# EAGLE design untitled (EAGLE 6.3)
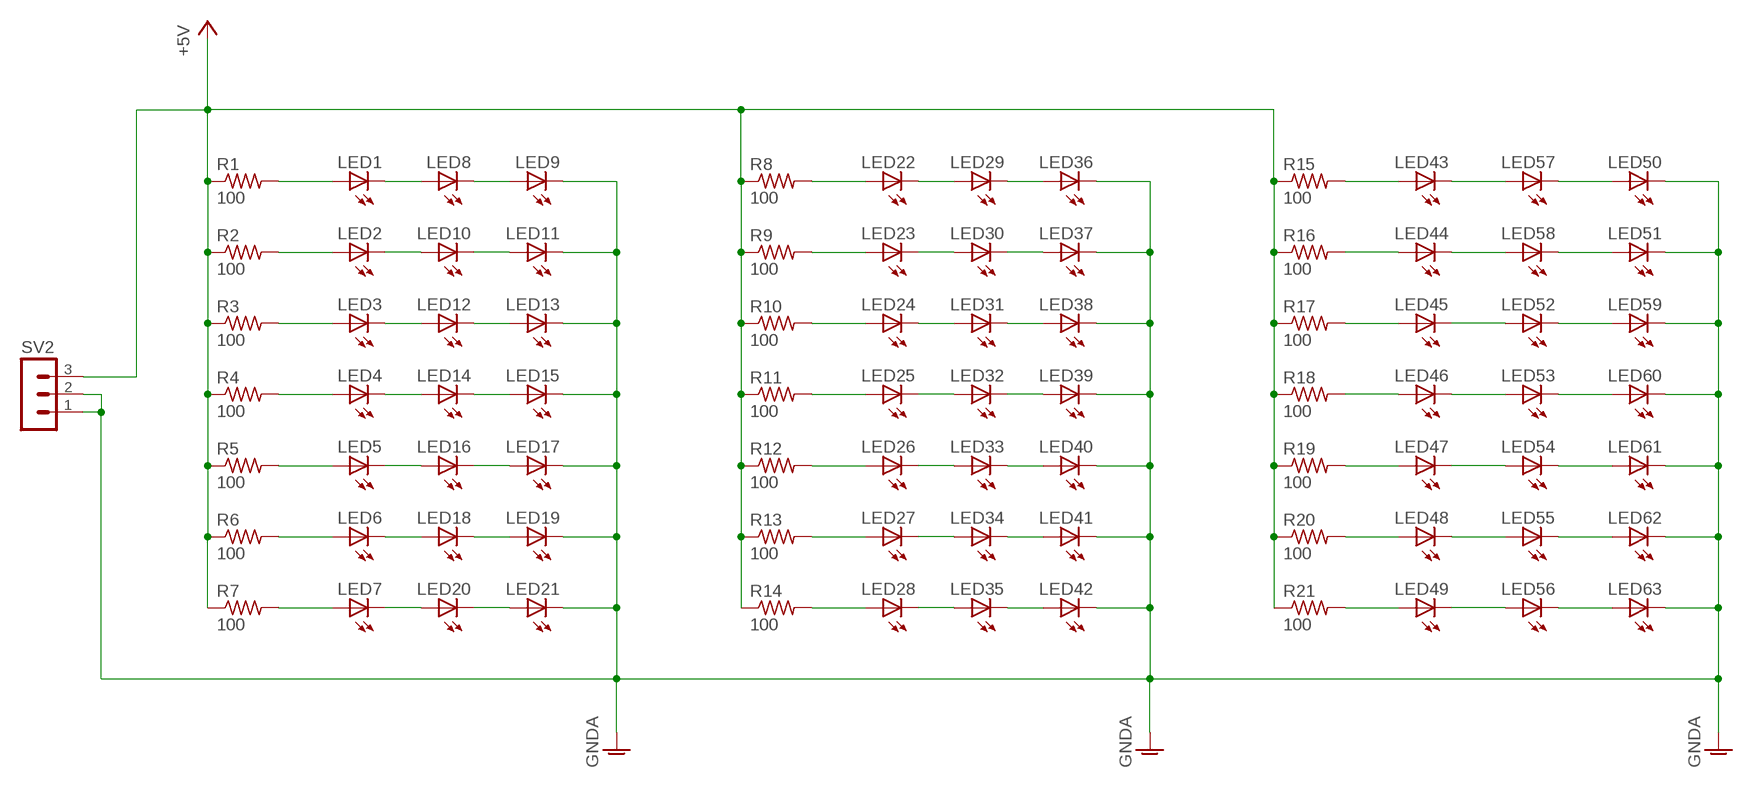
[diagram p0: schematic, sheet 1]

## Parts
LED1  LED5MM  [LED5MM]
LED2  LED5MM  [LED5MM]
LED3  LED5MM  [LED5MM]
LED4  LED5MM  [LED5MM]
LED5  LED5MM  [LED5MM]
LED6  LED5MM  [LED5MM]
LED7  LED5MM  [LED5MM]
LED8  LED5MM  [LED5MM]
LED9  LED5MM  [LED5MM]
LED10  LED5MM  [LED5MM]
LED11  LED5MM  [LED5MM]
LED12  LED5MM  [LED5MM]
LED13  LED5MM  [LED5MM]
LED14  LED5MM  [LED5MM]
LED15  LED5MM  [LED5MM]
LED16  LED5MM  [LED5MM]
LED17  LED5MM  [LED5MM]
LED18  LED5MM  [LED5MM]
LED19  LED5MM  [LED5MM]
LED20  LED5MM  [LED5MM]
LED21  LED5MM  [LED5MM]
LED22  LED5MM  [LED5MM]
LED23  LED5MM  [LED5MM]
LED24  LED5MM  [LED5MM]
LED25  LED5MM  [LED5MM]
LED26  LED5MM  [LED5MM]
LED27  LED5MM  [LED5MM]
LED28  LED5MM  [LED5MM]
LED29  LED5MM  [LED5MM]
LED30  LED5MM  [LED5MM]
LED31  LED5MM  [LED5MM]
LED32  LED5MM  [LED5MM]
LED33  LED5MM  [LED5MM]
LED34  LED5MM  [LED5MM]
LED35  LED5MM  [LED5MM]
LED36  LED5MM  [LED5MM]
LED37  LED5MM  [LED5MM]
LED38  LED5MM  [LED5MM]
LED39  LED5MM  [LED5MM]
LED40  LED5MM  [LED5MM]
LED41  LED5MM  [LED5MM]
LED42  LED5MM  [LED5MM]
LED43  LED5MM  [LED5MM]
LED44  LED5MM  [LED5MM]
LED45  LED5MM  [LED5MM]
LED46  LED5MM  [LED5MM]
LED47  LED5MM  [LED5MM]
LED48  LED5MM  [LED5MM]
LED49  LED5MM  [LED5MM]
LED50  LED5MM  [LED5MM]
LED51  LED5MM  [LED5MM]
LED52  LED5MM  [LED5MM]
LED53  LED5MM  [LED5MM]
LED54  LED5MM  [LED5MM]
LED55  LED5MM  [LED5MM]
LED56  LED5MM  [LED5MM]
LED57  LED5MM  [LED5MM]
LED58  LED5MM  [LED5MM]
LED59  LED5MM  [LED5MM]
LED60  LED5MM  [LED5MM]
LED61  LED5MM  [LED5MM]
LED62  LED5MM  [LED5MM]
LED63  LED5MM  [LED5MM]
R1  100  R-US_0204/5  [0204/5]
R2  100  R-US_0204/5  [0204/5]
R3  100  R-US_0204/5  [0204/5]
R4  100  R-US_0204/5  [0204/5]
R5  100  R-US_0204/5  [0204/5]
R6  100  R-US_0204/5  [0204/5]
R7  100  R-US_0204/5  [0204/5]
R8  100  R-US_0204/5  [0204/5]
R9  100  R-US_0204/5  [0204/5]
R10  100  R-US_0204/5  [0204/5]
R11  100  R-US_0204/5  [0204/5]
R12  100  R-US_0204/5  [0204/5]
R13  100  R-US_0204/5  [0204/5]
R14  100  R-US_0204/5  [0204/5]
R15  100  R-US_0204/5  [0204/5]
R16  100  R-US_0204/5  [0204/5]
R17  100  R-US_0204/5  [0204/5]
R18  100  R-US_0204/5  [0204/5]
R19  100  R-US_0204/5  [0204/5]
R20  100  R-US_0204/5  [0204/5]
R21  100  R-US_0204/5  [0204/5]
SV2  MA03-1  [MA03-1]

## Nets
+5V: R1.1 R2.1 R3.1 R4.1 R5.1 R6.1 R7.1 R8.1 R9.1 R10.1 R11.1 R12.1 R13.1 R14.1 R15.1 R16.1 R17.1 R18.1 R19.1 R20.1 R21.1 SV2.3
GNDA: LED9.K(C) LED11.K(C) LED13.K(C) LED15.K(C) LED17.K(C) LED19.K(C) LED21.K(C) LED36.K(C) LED37.K(C) LED38.K(C) LED39.K(C) LED40.K(C) LED41.K(C) LED42.K(C) LED50.K(C) LED51.K(C) LED59.K(C) LED60.K(C) LED61.K(C) LED62.K(C) LED63.K(C) SV2.1 SV2.2
N$1: LED43.K(C) LED57.A
N$2: LED52.K(C) LED59.A
N$3: LED1.A R1.2
N$4: LED2.A R2.2
N$5: LED3.A R3.2
N$6: LED4.A R4.2
N$7: LED5.A R5.2
N$8: LED6.A R6.2
N$9: LED7.A R7.2
N$10: LED53.K(C) LED60.A
N$11: LED1.K(C) LED8.A
N$12: LED8.K(C) LED9.A
N$13: LED10.K(C) LED11.A
N$14: LED2.K(C) LED10.A
N$15: LED3.K(C) LED12.A
N$16: LED12.K(C) LED13.A
N$17: LED54.K(C) LED61.A
N$18: LED4.K(C) LED14.A
N$19: LED14.K(C) LED15.A
N$20: LED16.K(C) LED17.A
N$21: LED5.K(C) LED16.A
N$22: LED6.K(C) LED18.A
N$23: LED18.K(C) LED19.A
N$24: LED20.K(C) LED21.A
N$25: LED7.K(C) LED20.A
N$26: LED55.K(C) LED62.A
N$27: LED56.K(C) LED63.A
N$28: LED22.A R8.2
N$29: LED23.A R9.2
N$30: LED24.A R10.2
N$31: LED25.A R11.2
N$32: LED26.A R12.2
N$33: LED27.A R13.2
N$34: LED28.A R14.2
N$35: LED22.K(C) LED29.A
N$36: LED29.K(C) LED36.A
N$37: LED30.K(C) LED37.A
N$38: LED23.K(C) LED30.A
N$39: LED24.K(C) LED31.A
N$40: LED31.K(C) LED38.A
N$41: LED32.K(C) LED39.A
N$42: LED25.K(C) LED32.A
N$43: LED26.K(C) LED33.A
N$44: LED27.K(C) LED34.A
N$45: LED28.K(C) LED35.A
N$46: LED33.K(C) LED40.A
N$47: LED34.K(C) LED41.A
N$48: LED35.K(C) LED42.A
N$49: LED50.A LED57.K(C)
N$50: LED51.A LED58.K(C)
N$51: LED44.K(C) LED58.A
N$52: LED43.A R15.2
N$53: LED44.A R16.2
N$54: LED45.A R17.2
N$55: LED46.A R18.2
N$56: LED47.A R19.2
N$57: LED48.A R20.2
N$58: LED49.A R21.2
N$59: LED45.K(C) LED52.A
N$60: LED46.K(C) LED53.A
N$61: LED47.K(C) LED54.A
N$62: LED48.K(C) LED55.A
N$63: LED49.K(C) LED56.A

## Library data of the parts
LED1-LED63 = adafruit:LED: LED OSRAM: - CHIPLED LG R971, LG N971, LY N971, LG Q971, LY Q971, LO R971, LY R971 LH N974, LH R974 LS Q976, LO Q976, LY Q976 LO Q996 - Hyper CHIPLED LW Q18S LB Q993, LB Q99A, LB R99A - SideLED LS A670, LO A670, LY A670, LG A670, LP A670 LB A673, LV A673, LT A673, LW A673 LH A674 LY A675 LS A676, LA A676, LO A676, LY A676, LW A676 LS A679, LY A679, LG A679 - Hyper Micro SIDELED® LS Y876, LA Y876, LO Y876, LY Y876 LT Y87S - SmartLED LW L88C, LW L88S LB L89C, LB L89S, LG L890 LS L89K, LO L89K, LY L89K LS L896, LA L896, LO L896, LY L896 - TOPLED LS T670, LO T670, LY T670, LG T670, LP T670 LSG T670, LSP T670, LSY T670, LOP T670, LYG T670 LG T671, LOG T671, LSG T671 LB T673, LV T673, LT T673, LW T673 LH T674 LS T676, LA T676, LO T676, LY T676, LB T676, LH T676, LSB T676, LW T676 LB T67C, LV T67C, LT T67C, LS T67K, LO T67K, LY T67K, LW E67C LS E67B, LA E67B, LO E67B, LY E67B, LB E67C, LV E67C, LT E67C LW T67C LS T679, LY T679, LG T679 LS T770, LO T770, LY T770, LG T770, LP T770 LB T773, LV T773, LT T773, LW T773 LH T774 LS E675, LA E675, LY E675, LS T675 LS T776, LA T776, LO T776, LY T776, LB T776 LHGB T686 LT T68C, LB T68C - Hyper Mini TOPLED® LB M676 - Mini TOPLED Santana® LG M470 LS M47K, LO M47K, LY M47K Source: http://www.osram.convergy.de/
R1-R21 = adafruit:R-US_: RESISTOR, American symbol
SV2 = con-lstb:MA03-1: PIN HEADER; OC_FARNELL: unknown; OC_NEWARK: unknown

## Net classes
0 default: width 0.813 mm, drill 0.914 mm, clearance 0.813 mm

## Board
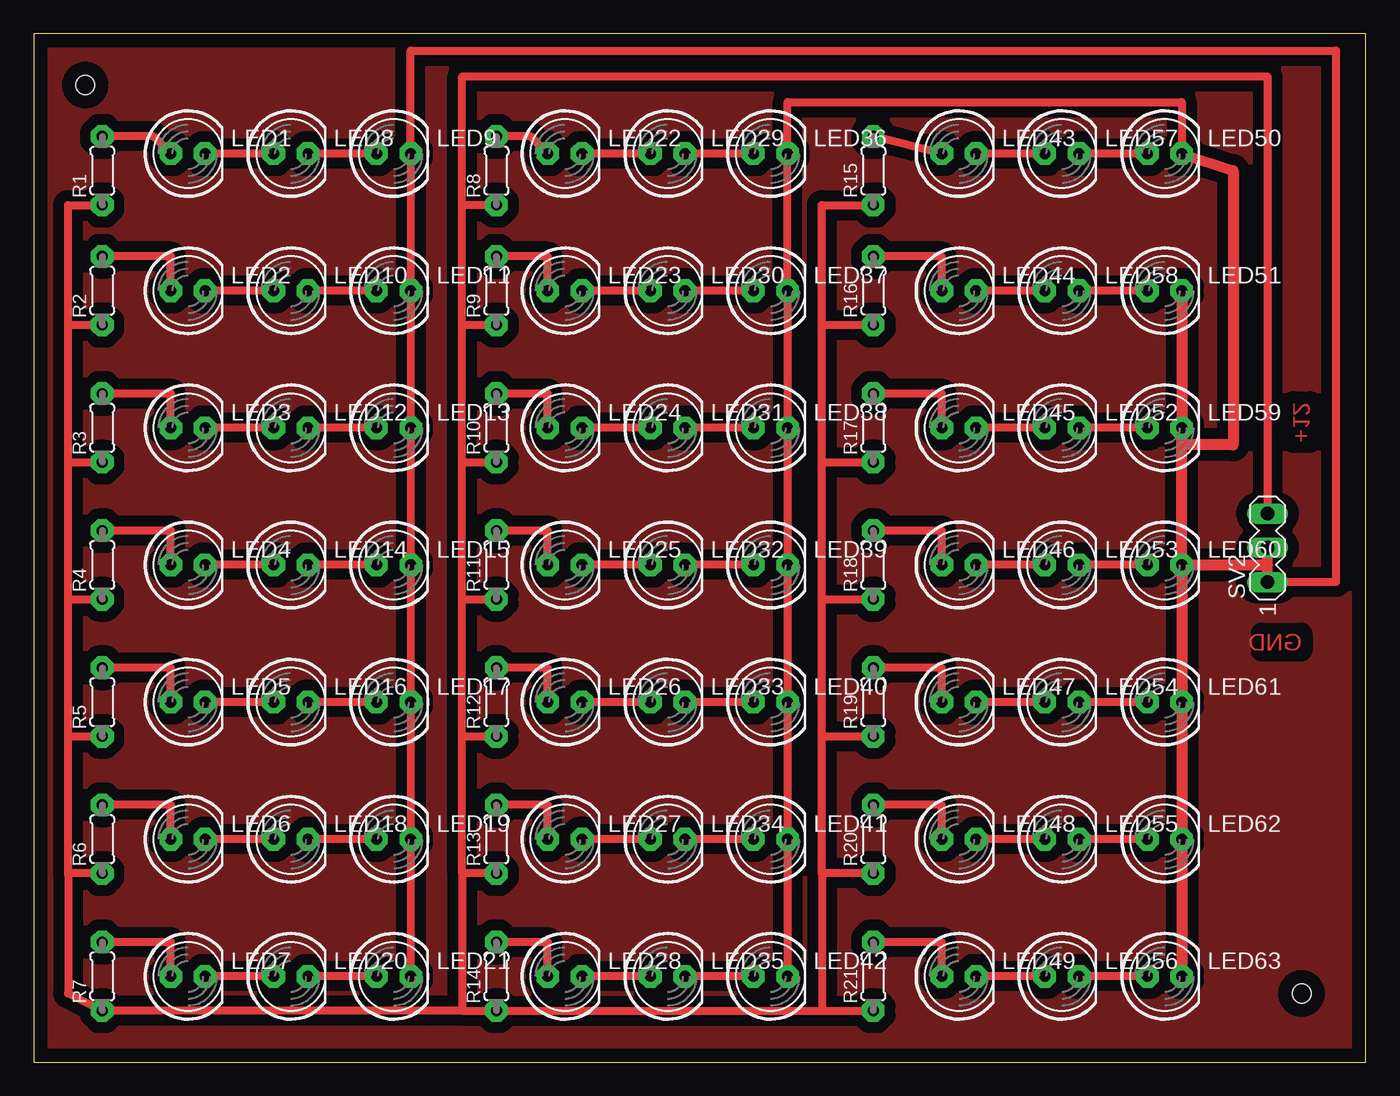
[diagram p1: board, top side]

Size 98.73 x 76.19 mm. Coordinates in mm from the lower left corner, seen from the top.
Outline: 0,0 98.73,0 98.73,76.19 0,76.19 0,0
Copper layers (1*16): Top 0.035mm / dielectric 1.5mm / Bottom 0.035mm
Design rules "default": minimum track width 10mil, minimum drill 24mil, track to track 8mil, track to pad 8mil, pad to pad 8mil, via to via 8mil, smd to smd 8mil, copper to edge 40mil, drill to drill 8mil, minimum pad ring 10mil, minimum via ring 8mil, stop-mask expansion 4mil, vias tented up to drill 0mil, thermal gap 10mil
Holes 1.4 mm at 3.81,72.39 93.98,5.08

### Footprints (pad centres in the part's own frame; a part is rotated, then mirrored left to right if it is on the bottom)
LED5MM = drill 0.813 pad 1.676 octagon: A -1.27,0; K 1.27,0
0204/5 = drill 0.813 pad 1.676 octagon: 1 -2.54,0; 2 2.54,0
MA03-1 = drill 1.016 long: 1 -2.54,0; 2 0,0; 3 2.54,0

### Placement (x,y rotation side)
LED1  11.43,67.31 0 top
LED2  11.43,57.15 0 top
LED3  11.43,46.99 0 top
LED4  11.43,36.83 0 top
LED5  11.43,26.67 0 top
LED6  11.43,16.51 0 top
LED7  11.43,6.35 0 top
LED8  19.05,67.31 0 top
LED9  26.67,67.31 0 top
LED10  19.05,57.15 0 top
LED11  26.67,57.15 0 top
LED12  19.05,46.99 0 top
LED13  26.67,46.99 0 top
LED14  19.05,36.83 0 top
LED15  26.67,36.83 0 top
LED16  19.05,26.67 0 top
LED17  26.67,26.67 0 top
LED18  19.05,16.51 0 top
LED19  26.67,16.51 0 top
LED20  19.05,6.35 0 top
LED21  26.67,6.35 0 top
LED22  39.37,67.31 0 top
LED23  39.37,57.15 0 top
LED24  39.37,46.99 0 top
LED25  39.37,36.83 0 top
LED26  39.37,26.67 0 top
LED27  39.37,16.51 0 top
LED28  39.37,6.35 0 top
LED29  46.99,67.31 0 top
LED30  46.99,57.15 0 top
LED31  46.99,46.99 0 top
LED32  46.99,36.83 0 top
LED33  46.99,26.67 0 top
LED34  46.99,16.51 0 top
LED35  46.99,6.35 0 top
LED36  54.61,67.31 0 top
LED37  54.61,57.15 0 top
LED38  54.61,46.99 0 top
LED39  54.61,36.83 0 top
LED40  54.61,26.67 0 top
LED41  54.61,16.51 0 top
LED42  54.61,6.35 0 top
LED43  68.58,67.31 0 top
LED44  68.58,57.15 0 top
LED45  68.58,46.99 0 top
LED46  68.58,36.83 0 top
LED47  68.58,26.67 0 top
LED48  68.58,16.51 0 top
LED49  68.58,6.35 0 top
LED50  83.82,67.31 0 top
LED51  83.82,57.15 0 top
LED52  76.2,46.99 0 top
LED53  76.2,36.83 0 top
LED54  76.2,26.67 0 top
LED55  76.2,16.51 0 top
LED56  76.2,6.35 0 top
LED57  76.2,67.31 0 top
LED58  76.2,57.15 0 top
LED59  83.82,46.99 0 top
LED60  83.82,36.83 0 top
LED61  83.82,26.67 0 top
LED62  83.82,16.51 0 top
LED63  83.82,6.35 0 top
R1  5.08,66.04 90 top
R2  5.08,57.15 90 top
R3  5.08,46.99 90 top
R4  5.08,36.83 90 top
R5  5.08,26.67 90 top
R6  5.08,16.51 90 top
R7  5.08,6.35 90 top
R8  34.29,66.04 90 top
R9  34.29,57.15 90 top
R10  34.29,46.99 90 top
R11  34.29,36.83 90 top
R12  34.29,26.67 90 top
R13  34.29,16.51 90 top
R14  34.29,6.35 90 top
R15  62.23,66.04 90 top
R16  62.23,57.15 90 top
R17  62.23,46.99 90 top
R18  62.23,36.83 90 top
R19  62.23,26.67 90 top
R20  62.23,16.51 90 top
R21  62.23,6.35 90 top
SV2  91.44,38.1 90 top

### Tracks (layer width: path | path; a pad name or v marks a point on that pad's centre or on a via)
+5V
  Top 0.61: 58.42,13.97 58.42,3.81 R21.1 R14.1 31.75,3.81 | R20.1 58.42,13.97 | 58.42,24.13 R19.1 | 58.42,13.97 58.42,24.13 | 58.42,34.29 R18.1 | 58.42,24.13 58.42,34.29 | 58.42,44.45 R17.1 | 58.42,34.29 58.42,44.45 | 58.42,54.61 R16.1 | 58.42,44.45 58.42,54.61 | R15.1 58.42,63.5 58.42,54.61 | 2.54,13.97 2.54,5.08 R7.1 31.75,3.81 | R6.1 2.54,13.97 | 2.54,24.13 R5.1 | 2.54,13.97 2.54,24.13 | 2.54,34.29 R4.1 | 2.54,24.13 2.54,34.29 | 2.54,44.45 R3.1 | 2.54,34.29 2.54,44.45 | 2.54,54.61 R2.1 | 2.54,44.45 2.54,54.61 | R1.1 2.54,63.5 2.54,54.61 | SV2.3 91.44,73.03 31.75,73.03 31.75,63.5 | R8.1 31.75,63.5 | 31.75,13.97 31.75,3.81 | R13.1 31.75,13.97 | 31.75,24.13 R12.1 | 31.75,13.97 31.75,24.13 | 31.75,34.29 R11.1 | 31.75,24.13 31.75,34.29 | 31.75,44.45 R10.1 | 31.75,34.29 31.75,44.45 | 31.75,54.61 R9.1 | 31.75,44.45 31.75,54.61 | 31.75,54.61 31.75,63.5
GND
  pour Top: 0,76.2 99.06,76.2 99.06,0 0,0
GNDA
  Top 0.61: LED42.K LED41.K LED40.K LED39.K LED38.K LED37.K LED36.K 55.88,71.12 85.09,71.12 LED50.K | LED21.K LED19.K LED17.K LED15.K LED13.K LED11.K LED9.K 27.94,74.93 96.52,74.93 96.52,35.56 SV2.1
  Top 0.813: LED51.K LED59.K 85.09,45.72 | LED63.K LED62.K LED61.K LED60.K | SV2.1 91.44,36.83 | 91.44,36.83 SV2.2 | LED60.K 91.44,36.83 | LED60.K 85.09,45.72 | 85.09,45.72 88.9,45.72 88.9,66.04 LED50.K
N$1
  Top 0.61: LED57.A LED43.K
N$2
  Top 0.61: LED59.A LED52.K
N$3
  Top 0.61: R1.2 8.89,68.58 LED1.A
N$4
  Top 0.61: R2.2 10.16,59.69 LED2.A
N$5
  Top 0.61: R3.2 10.16,49.53 LED3.A
N$6
  Top 0.61: R4.2 10.16,39.37 LED4.A
N$7
  Top 0.61: R5.2 10.16,29.21 LED5.A
N$8
  Top 0.61: R6.2 10.16,19.05 LED6.A
N$9
  Top 0.61: R7.2 10.16,8.89 LED7.A
N$10
  Top 0.61: LED60.A LED53.K
N$11
  Top 0.61: LED8.A LED1.K
N$12
  Top 0.61: LED9.A LED8.K
N$13
  Top 0.61: LED11.A LED10.K
N$14
  Top 0.61: LED10.A LED2.K
N$15
  Top 0.61: LED12.A LED3.K
N$16
  Top 0.61: LED13.A LED12.K
N$17
  Top 0.61: LED61.A LED54.K
N$18
  Top 0.61: LED14.A LED4.K
N$19
  Top 0.61: LED15.A LED14.K
N$20
  Top 0.61: LED17.A LED16.K
N$21
  Top 0.61: LED16.A LED5.K
N$22
  Top 0.61: LED18.A LED6.K
N$23
  Top 0.61: LED19.A LED18.K
N$24
  Top 0.61: LED21.A LED20.K
N$25
  Top 0.61: LED20.A LED7.K
N$26
  Top 0.61: LED62.A LED55.K
N$27
  Top 0.61: LED63.A LED56.K
N$28
  Top 0.61: R8.2 36.83,68.58 LED22.A
N$29
  Top 0.61: R9.2 38.1,59.69 LED23.A
N$30
  Top 0.61: R10.2 38.1,49.53 LED24.A
N$31
  Top 0.61: R11.2 38.1,39.37 LED25.A
N$32
  Top 0.61: R12.2 38.1,29.21 LED26.A
N$33
  Top 0.61: R13.2 38.1,19.05 LED27.A
N$34
  Top 0.61: R14.2 38.1,8.89 LED28.A
N$35
  Top 0.61: LED29.A LED22.K
N$36
  Top 0.61: LED36.A LED29.K
N$37
  Top 0.61: LED37.A LED30.K
N$38
  Top 0.61: LED30.A LED23.K
N$39
  Top 0.61: LED31.A LED24.K
N$40
  Top 0.61: LED38.A LED31.K
N$41
  Top 0.61: LED39.A LED32.K
N$42
  Top 0.61: LED32.A LED25.K
N$43
  Top 0.61: LED33.A LED26.K
N$44
  Top 0.61: LED34.A LED27.K
N$45
  Top 0.61: LED35.A LED28.K
N$46
  Top 0.61: LED40.A LED33.K
N$47
  Top 0.61: LED41.A LED34.K
N$48
  Top 0.61: LED42.A LED35.K
N$49
  Top 0.61: LED50.A LED57.K
N$50
  Top 0.61: LED51.A LED58.K
N$51
  Top 0.61: LED58.A LED44.K
N$52
  Top 0.61: LED43.A R15.2
N$53
  Top 0.61: R16.2 67.31,59.69 LED44.A
N$54
  Top 0.61: R17.2 67.31,49.53 LED45.A
N$55
  Top 0.61: R18.2 67.31,39.37 LED46.A
N$56
  Top 0.61: R19.2 67.31,29.21 LED47.A
N$57
  Top 0.61: R20.2 67.31,19.05 LED48.A
N$58
  Top 0.61: R21.2 67.31,8.89 LED49.A
N$59
  Top 0.61: LED52.A LED45.K
N$60
  Top 0.61: LED53.A LED46.K
N$61
  Top 0.61: LED54.A LED47.K
N$62
  Top 0.61: LED55.A LED48.K
N$63
  Top 0.61: LED56.A LED49.K

### Text on the board
Top: +12 | GND